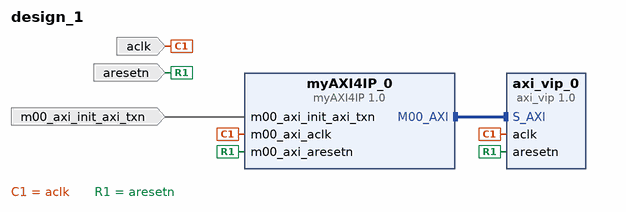
[diagram p0: block diagram of the top level]
# Vivado block design design_1, xc7z020clg484-1, Vivado 2017.1
create_bd_design design_1

create_bd_port -dir I -type clk aclk
create_bd_port -dir I -type rst aresetn
create_bd_port -dir I m00_axi_init_axi_txn

create_bd_cell -type ip -vlnv xilinx.com:user:myAXI4IP:1.0 myAXI4IP_0
set_property -dict {CONFIG.C_M00_AXI_TARGET_SLAVE_BASE_ADDR 0x00000E00} [get_bd_cells myAXI4IP_0]
create_bd_cell -type ip -vlnv xilinx.com:ip:axi_vip:1.0 axi_vip_0
set_property -dict {CONFIG.INTERFACE_MODE SLAVE} [get_bd_cells axi_vip_0]

# ---- connections ----

connect_bd_intf_net [get_bd_intf_pins myAXI4IP_0/M00_AXI] [get_bd_intf_pins axi_vip_0/S_AXI]
connect_bd_net [get_bd_ports aclk] [get_bd_pins axi_vip_0/aclk] [get_bd_pins myAXI4IP_0/m00_axi_aclk]
connect_bd_net [get_bd_ports aresetn] [get_bd_pins axi_vip_0/aresetn] [get_bd_pins myAXI4IP_0/m00_axi_aresetn]
connect_bd_net [get_bd_ports m00_axi_init_axi_txn] [get_bd_pins myAXI4IP_0/m00_axi_init_axi_txn]

# ---- address map ----
assign_bd_address -offset 0x00000000 -range 4K -target_address_space [get_bd_addr_spaces myAXI4IP_0/M00_AXI] [get_bd_addr_segs axi_vip_0/S_AXI/Reg]

validate_bd_design
save_bd_design
